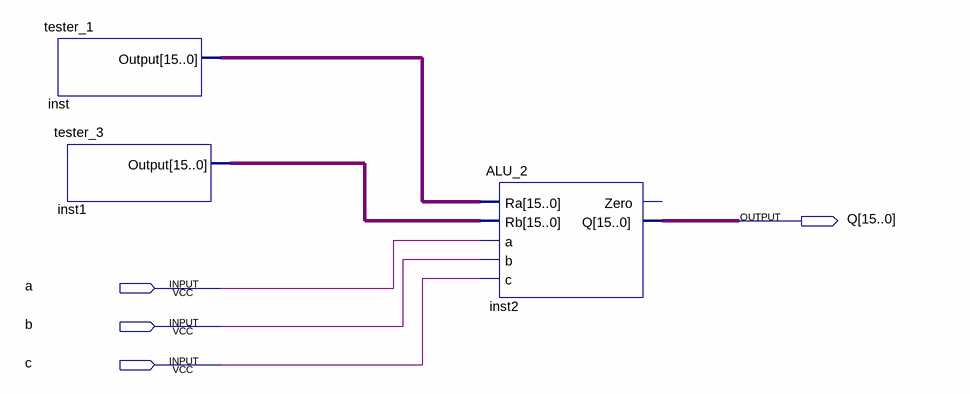
[diagram p0: schematic sheet]
// Quartus schematic test_ALU_2.bdf as structural Verilog: 3 symbols, 4 pins
module test_ALU_2 (
  input  a,
  input  b,
  input  c,
  output [15:0] Q
);

  wire [15:0] inst1_output, inst_output;

  tester_1 inst (.Output(inst_output));
  tester_3 inst1 (.Output(inst1_output));
  ALU_2 inst2 (.Ra(inst_output), .Rb(inst1_output), .a(a), .b(b), .c(c), .Q(Q));  // open: Zero
endmodule
